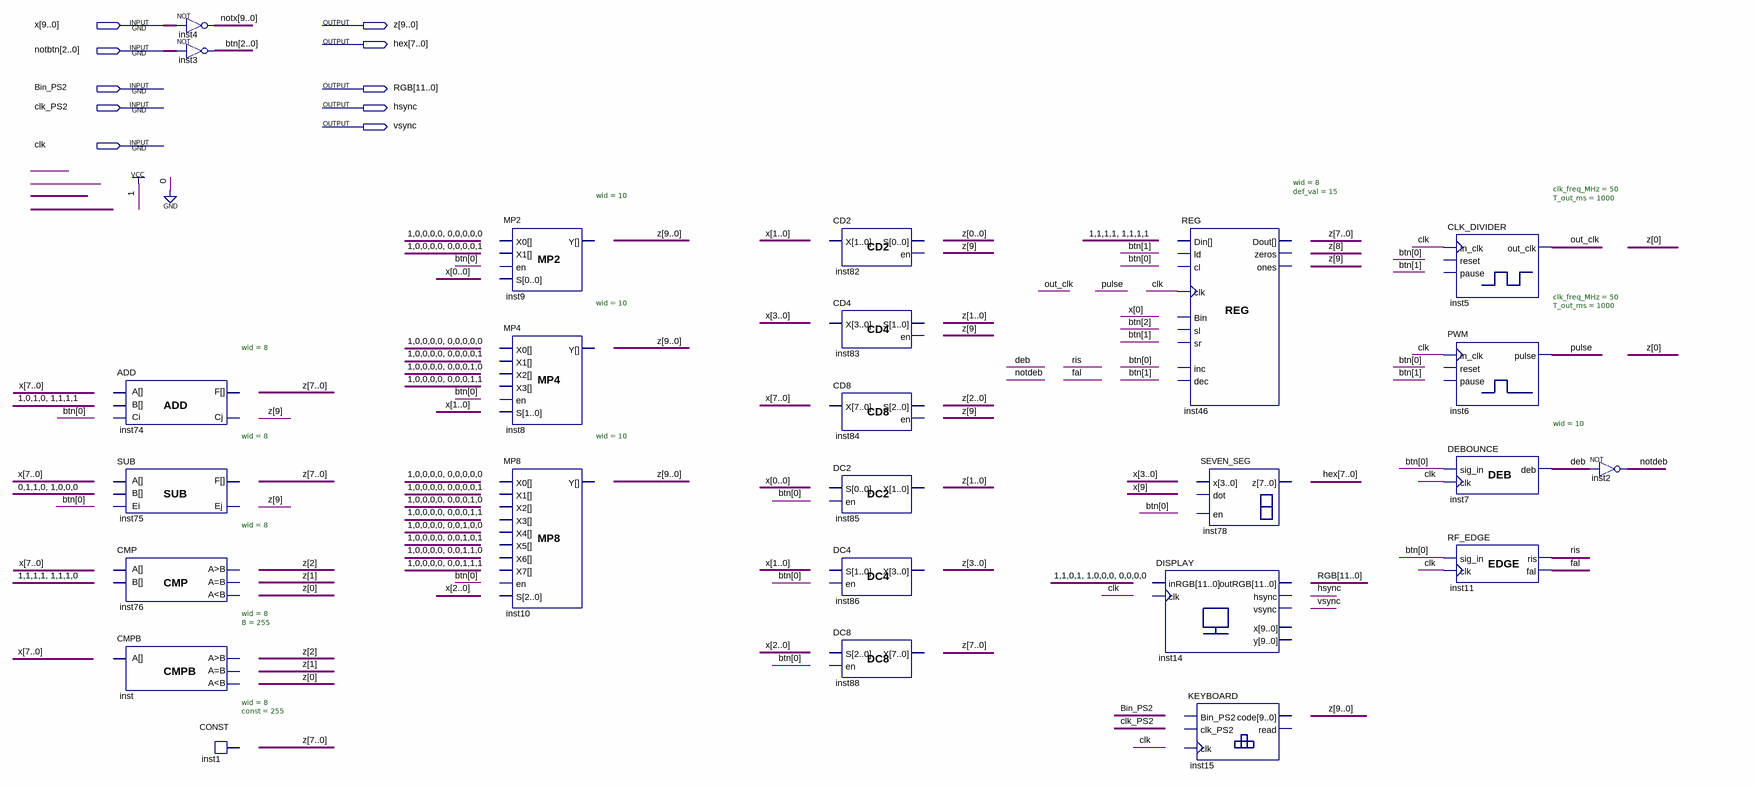
[diagram p0: schematic sheet]
// Quartus schematic test.bdf as structural Verilog: 25 symbols, 10 pins
module test (
  input  [9:0] x,
  input  [2:0] notbtn,
  input  Bin_PS2,
  input  clk_PS2,
  input  clk,
  output [9:0] z,
  output [7:0] hex,
  output [11:0] RGB,
  output hsync,
  output vsync
);

  wire deb, fal, notdeb, out_clk, pulse, ris;
  wire [2:0] btn;
  wire [9:0] notx;

  ADD #(.wid(8)) inst74 ();  // open: A, B, Ci, F, Cj
  SUB #(.wid(8)) inst75 ();  // open: A, B, Ei, F, Ej
  CMP #(.wid(8)) inst76 ();  // open: A, B, gr, eq, ls
  CMPB #(.wid(8), .B(255)) inst ();  // open: A, gr, eq, ls
  assign notx = ~x;  // NOT inst4, 10 bits wide
  assign btn = ~notbtn;  // NOT inst3, 3 bits wide
  CONST #(.wid(8), .\const (255)) inst1 ();  // open: data
  MP2 #(.wid(10)) inst9 ();  // open: X0, X1, en, S, Y
  MP4 #(.wid(10)) inst8 ();  // open: X0, X1, X2, X3, en, S, Y
  MP8 #(.wid(10)) inst10 ();  // open: X0, X1, X2, X3, X4, X5, X6, X7, en, S, Y
  CD2 inst82 ();  // open: X, S, en
  CD4 inst83 ();  // open: X, S, en
  CD8 inst84 ();  // open: X, S, en
  DC2 inst85 ();  // open: S, en, X
  DC4 inst86 ();  // open: S, en, X
  DC8 inst88 ();  // open: S, en, X
  DISPLAY inst14 ();  // open: inRGB, clk, outRGB, hsync, vsync, x, y
  REG #(.wid(8), .def_val(15)) inst46 (.clk(clk));  // open: ld, cl, Bin, sl, sr, inc, dec, Din, Dout, zeros, ones
  SEVEN_SEG inst78 ();  // open: x, dot, en, z
  KEYBOARD inst15 ();  // open: Bin_PS2, clk_PS2, clk, code, read
  CLK_DIVIDER #(.clk_freq_MHz(50), .T_out_ms(1000)) inst5 (.in_clk(clk), .out_clk(out_clk));  // open: reset, pause
  PWM #(.clk_freq_MHz(50), .T_out_ms(1000)) inst6 (.in_clk(clk), .pulse(pulse));  // open: reset, pause
  DEBOUNCE #(.wid(10)) inst7 (.sig_in(btn[0]), .clk(clk), .deb(deb));
  RF_EDGE inst11 (.sig_in(btn[0]), .clk(clk), .ris(ris), .fal(fal));
  not inst2 (notdeb, deb);
endmodule
